# EAGLE design 3DAG (EAGLE 6.6.0)
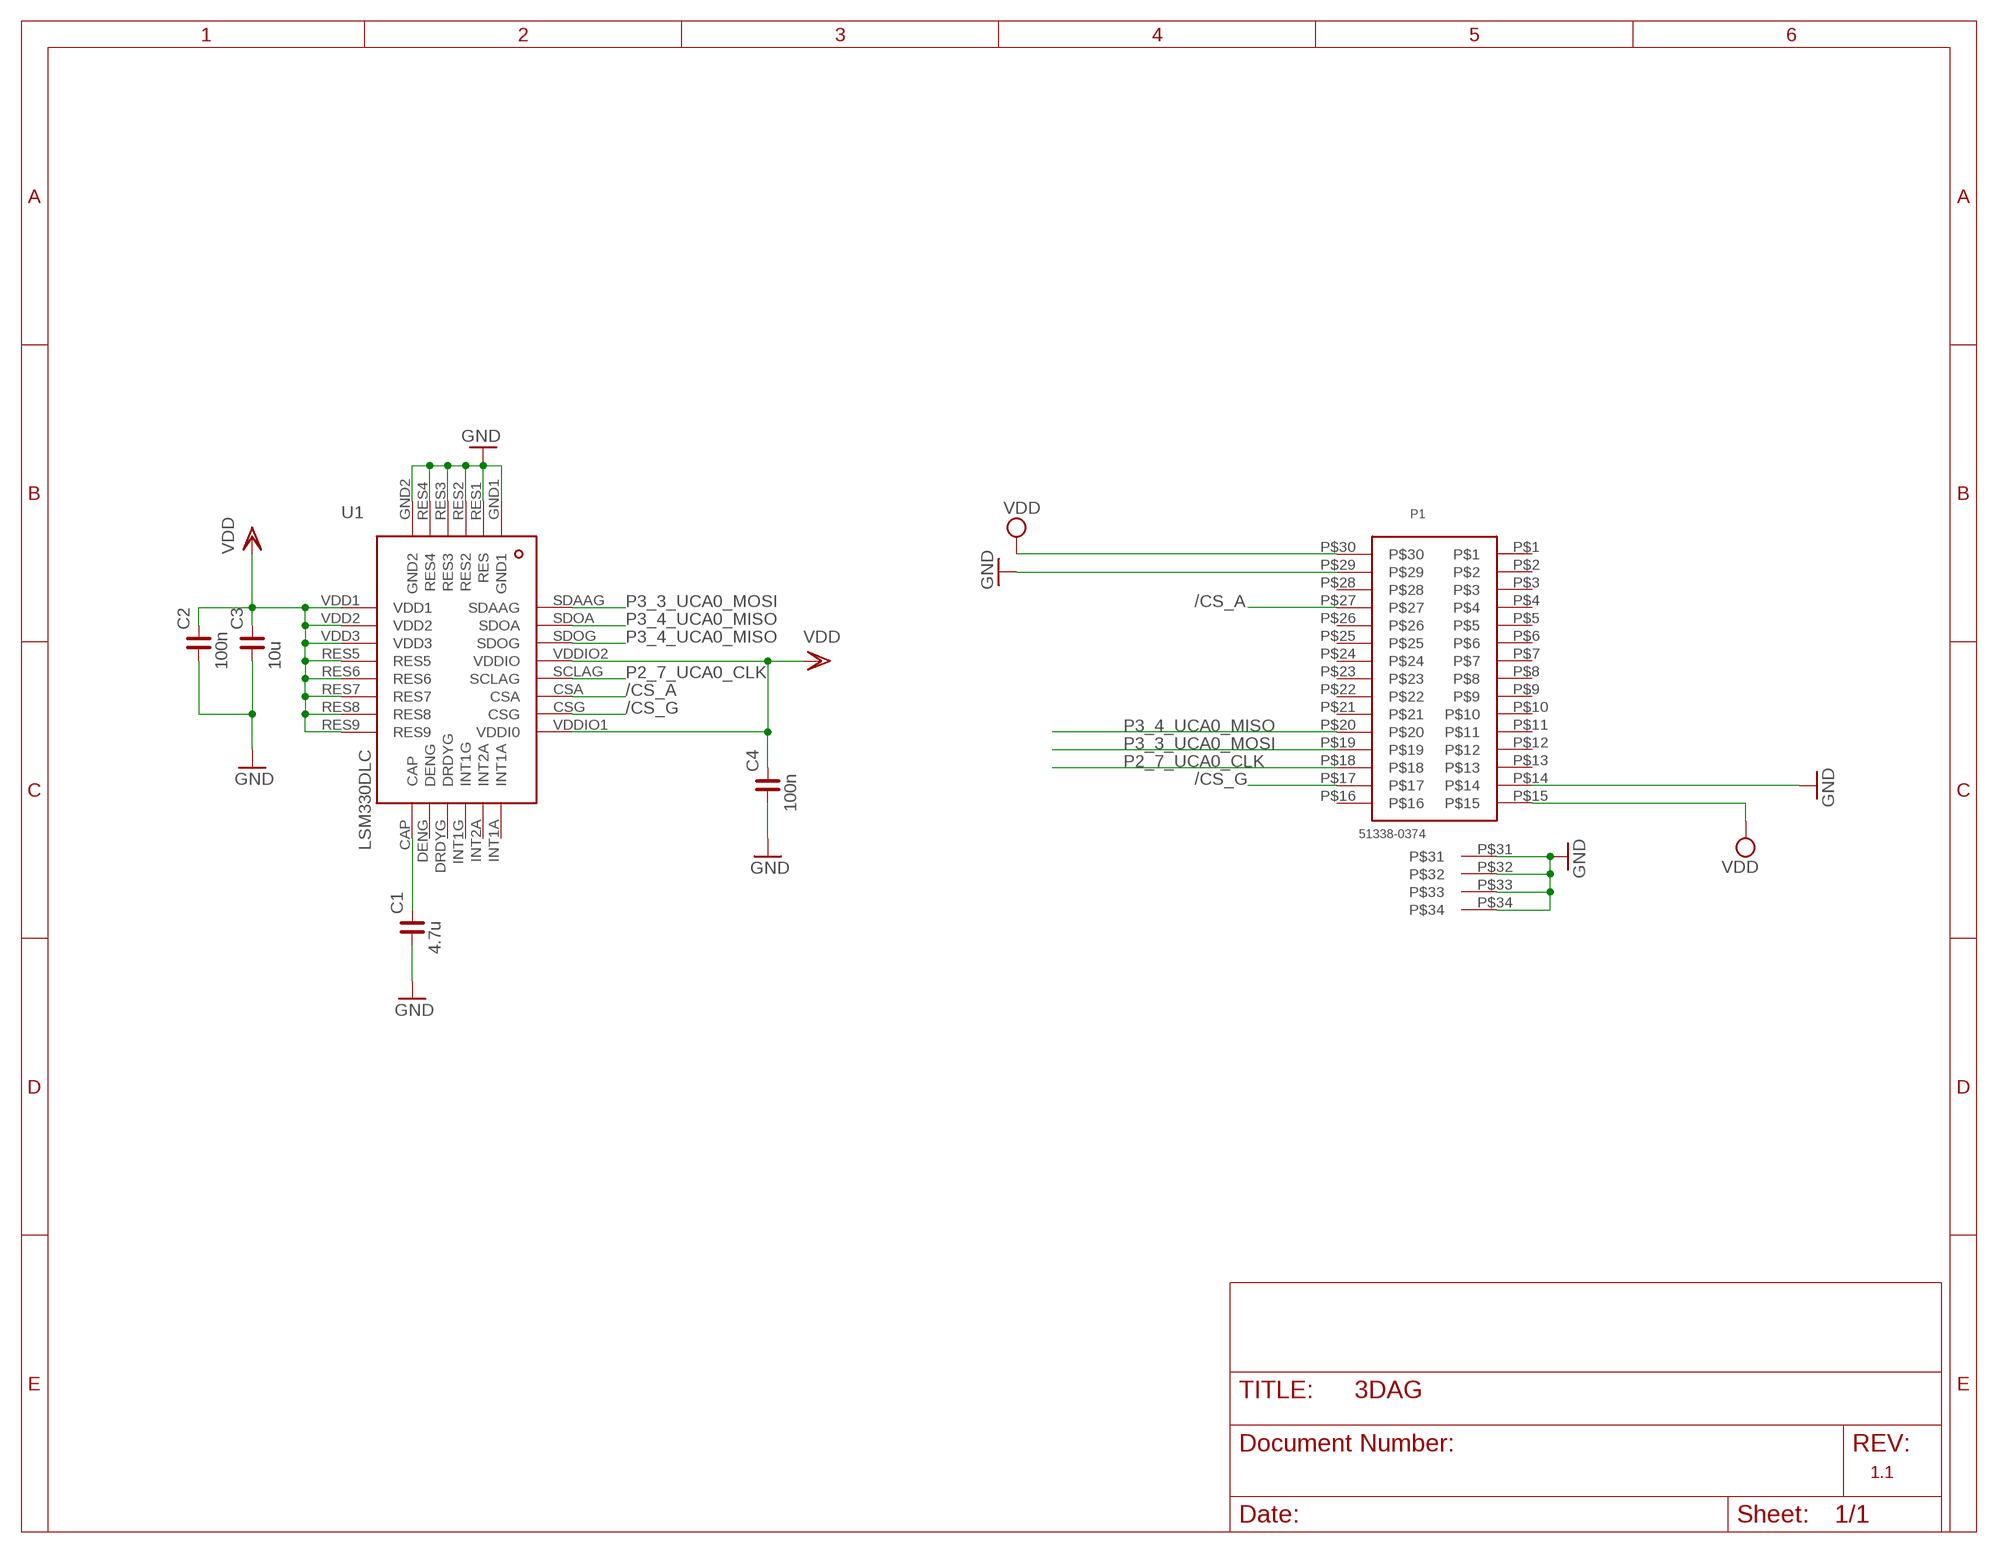
[diagram p0: schematic, sheet 1]

## Parts
C1  4.7u  C_0402  [C0402]
C2  100n  C_0402  [C0402]
C3  10u  C_0402  [C0402]
C4  100n  C_0402  [C0402]
P1  51338-0374  51338-0374_RECEPTACLE  [51338-0374_RECEPTACLE]
U$4  LSM330DLC  [LSM330DLC]

## Nets
/CS_A: P1.P$27 U$4.CSA
/CS_G: P1.P$17 U$4.CSG
GND: C1.1 C2.1 C3.1 C4.1 P1.P$14 P1.P$29 P1.P$31 P1.P$32 P1.P$33 P1.P$34 U$4.GND1 U$4.GND2 U$4.RES1(RES) U$4.RES2 U$4.RES3 U$4.RES4
N$5: C1.2 U$4.CAP
P2_7_UCA0_CLK: P1.P$18 U$4.SCLAG
P3_3_UCA0_MOSI: P1.P$19 U$4.SDAAG
P3_4_UCA0_MISO: P1.P$20 U$4.SDOA U$4.SDOG
VDD: C2.2 C3.2 C4.2 P1.P$15 P1.P$30 U$4.RES5 U$4.RES6 U$4.RES7 U$4.RES8 U$4.RES9 U$4.VDD1 U$4.VDD2 U$4.VDD3 U$4.VDDIO1(VDDI0) U$4.VDDIO2(VDDIO)
Unconnected: P1.P$1 P1.P$2 P1.P$3 P1.P$4 P1.P$5 P1.P$6 P1.P$7 P1.P$8 P1.P$9 P1.P$10 P1.P$11 P1.P$12 P1.P$13 P1.P$16 P1.P$21 P1.P$22 P1.P$23 P1.P$24 P1.P$25 P1.P$26 P1.P$28 U$4.DENG U$4.DRDYG U$4.INT1A U$4.INT1G U$4.INT2A

## Notes on the sheet
- U1
- 1.1

## Library data of the parts
C1-C4 = rc-master-smd:C_: NON-POLARIZED CAP
P1 = Molex_SlimStack:51338-0374_RECEPTACLE
U$4 = LSM330DLC:LSM330DLC

## Board
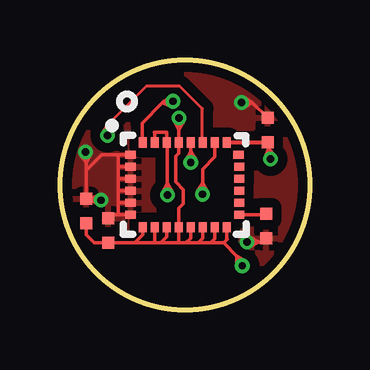
[diagram p1: board, top side]
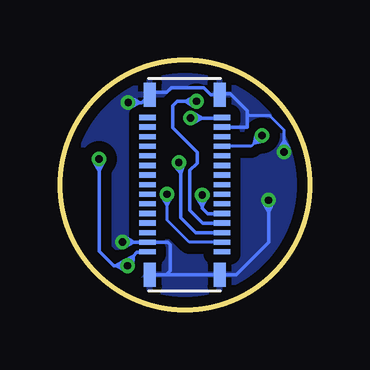
[diagram p2: board, bottom side, seen from below]

Size 10.4 x 10.4 mm. Coordinates in mm from the lower left corner, seen from the top.
Outline: circle at 5.2,5.2 radius 5.2
Copper layers (1*16): Top 0.035mm / dielectric 1.5mm / Bottom 0.035mm
Design rules "DIRTY_PCB": minimum track width 5mil, minimum drill 12mil, track to track 5mil, track to pad 5mil, pad to pad 5mil, via to via 5mil, smd to smd 0mil, copper to edge 10mil, drill to drill 10mil, minimum pad ring 10mil, minimum via ring 6mil, stop-mask expansion 2mil, vias tented up to drill 25mil, thermal gap 10mil

### Footprints (pad centres in the part's own frame; a part is rotated, then mirrored left to right if it is on the bottom)
C0402 = smd 0.5 x 0.5: 1 -0.508,0; 2 0.508,0
51338-0374_RECEPTACLE = smd 0.7 x 0.22: P$1 -1.55,2.8; P$2 -1.55,2.4; P$3 -1.55,2; P$4 -1.55,1.6; P$5 -1.55,1.2; P$6 -1.55,0.8; P$7 -1.55,0.4; P$8 -1.55,0; P$9 -1.55,-0.4; P$10 -1.55,-0.8; P$11 -1.55,-1.2; P$12 -1.55,-1.6; P$13 -1.55,-2; P$14 -1.55,-2.4; P$15 -1.55,-2.8; P$16 1.55,-2.8; P$17 1.55,-2.4; P$18 1.55,-2; P$19 1.55,-1.6; P$20 1.55,-1.2; P$21 1.55,-0.8; P$22 1.55,-0.4; P$23 1.55,0; P$24 1.55,0.4; P$25 1.55,0.8; P$26 1.55,1.2; P$27 1.55,1.6; P$28 1.55,2; P$29 1.55,2.4; P$30 1.55,2.8 | smd 0.5 x 1: P$31 1.45,3.75; P$32 -1.45,3.75; P$33 -1.45,-3.75; P$34 1.45,-3.75
LSM330DLC = smd 0.425 x 0.325: CAP 2.263,-1.25; DENG 2.263,-0.75; DRDYG 2.263,-0.25; GND1 -2.263,1.25; GND2 -2.263,-1.25; INT1A 2.237,1.25; INT1G 2.268,0.25; INT2A 2.263,0.75; RES1 -2.263,0.75; RES2 -2.263,0.25; RES3 -2.263,-0.25; RES4 -2.263,-0.75 | smd 0.325 x 0.425: CSA 0.75,1.762; CSG 1.25,1.762; RES5 -0.25,-1.762; RES6 0.25,-1.762; RES7 0.75,-1.762; RES8 1.25,-1.762; RES9 1.75,-1.762; SCLAG 0.25,1.762; SDAAG -1.75,1.762; SDOA -1.25,1.762; SDOG -0.75,1.762; VDD1 -1.75,-1.762; VDD2 -1.25,-1.762; VDD3 -0.75,-1.762; VDDIO1 1.75,1.762; VDDIO2 -0.25,1.762

### Placement (x,y rotation side)
C1  8.59,3.49 90 top
C2  2.02,3.29 270 top
C3  1.1,4.11 270 top
C4  8.65,7.48 270 top
P1  5.2,5.21 0 bottom
U$4  5.2,5.2 0 top

### Tracks (layer width: path | path; a pad name or v marks a point on that pad's centre or on a via)
/CS_A  (via drill 0.3)
  Top 0.127: U$4.CSA 5.93,6.98 5.93,8.37 5,9.31 3.59,9.31 1.99,7.71 | 1.99,7.71 v1.99,7.25 | 1.99,7.71 1.78,7.38 v1.99,7.25 | 1.99,7.71 2.19,7.38 v1.99,7.25
  Bottom 0.127: v1.99,7.25 2.31,6.93 | 2.31,6.93 2.43,6.81 P1.P$27 | 2.31,6.93 2.22,7.31 v1.99,7.25 | 2.31,6.93 1.93,7.02 v1.99,7.25
/CS_G  (via drill 0.3)
  Top 0.152: U$4.CSG 6.45,6.36 5.94,5.85 5.94,5.26 | 5.94,5.26 v5.94,4.81 | 5.94,5.26 5.74,4.92 v5.94,4.81 | 5.94,5.26 6.14,4.92 v5.94,4.81
  Bottom 0.127: P1.P$17 5.01,2.81 5.94,3.73 5.94,4.35 | 5.94,4.35 v5.94,4.81 | 5.94,4.35 6.14,4.68 v5.94,4.81 | 5.94,4.35 5.73,4.68 v5.94,4.81
  Bottom 0.152: v5.94,4.81
GND  (via drill 0.3)
  Top 0.152: 2.42,6.45 U$4.GND1 1.75,6.45 1.1,5.81 | 2.42,6.45 2.42,6.46 | 2.42,6.45 2.42,5.95 | 2.42,5.95 U$4.RES1 | U$4.RES2 2.42,5.45 | 2.42,5.45 2.42,5.95 | U$4.RES3 2.42,4.95 | 2.42,4.95 2.42,5.45 | U$4.RES4 2.42,4.45 | 2.42,4.45 2.42,4.95 | U$4.GND2 2.42,3.95 | 2.42,3.95 2.42,4.45 | 1.1,5.81 C3.1 1.26,4.61 | 2.42,3.95 2.17,3.95 C2.1 | v1.06,6.57 1.1,6.53 1.1,6.12 | 1.1,6.12 1.1,5.81 | v7.8,2.81 8.25,2.81 | 8.25,2.81 8.42,2.81 C1.1 | C4.1 8.02,8.62 | 8.02,8.62 8.01,8.62 v7.56,8.62 | v1.71,4.56 1.66,4.61 1.26,4.61 | 1.1,6.12 1.27,6.48 v1.06,6.57 | 1.1,6.12 0.87,6.44 v1.06,6.57 | 8.25,2.81 7.91,3.01 v7.8,2.81 | 8.25,2.81 7.91,2.62 v7.8,2.81 | 8.02,8.62 7.68,8.82 v7.56,8.62 | 8.02,8.62 7.67,8.43 v7.56,8.62 | 1.26,4.61 1.57,4.38 v1.71,4.56 | 1.26,4.61 1.62,4.77 v1.71,4.56
  Bottom 0.127: v1.06,6.57 1.06,7.03 | 1.06,7.03 1.06,7.48 1.66,8.08 2.5,8.08 2.6,8.19 | 1.06,7.03 0.86,6.7 v1.06,6.57 | 1.06,7.03 1.27,6.7 v1.06,6.57
  Bottom 0.152: P1.P$29 2.6,7.61 2.6,8.19 2.6,8.29 3.3,8.99 3.72,8.99 P1.P$31 4.12,8.96 4.41,9.25 5.76,9.25 5.95,9.05 6.56,9.05 P1.P$32 6.98,8.62 7.1,8.62 | 7.34,2.81 P1.P$14 5.91,2.8 5.8,2.7 5.8,1.62 5.97,1.46 P1.P$33 P1.P$34 3.05,1.45 1.71,2.8 1.71,4.1 | 7.34,2.81 v7.8,2.81 | 7.1,8.62 v7.56,8.62 | 1.71,4.1 v1.71,4.56 | 7.34,2.81 7.68,2.62 v7.8,2.81 | 7.34,2.81 7.68,3.01 v7.8,2.81 | 7.1,8.62 7.45,8.43 v7.56,8.62 | 7.1,8.62 7.45,8.82 v7.56,8.62 | 1.71,4.1 1.91,4.45 v1.71,4.56 | 1.71,4.1 1.51,4.45 v1.71,4.56
  pour Top (isolate 0.4): 0.2,5.2 arc-90 5.2,10.2 arc-90 10.2,5.2 arc-90 5.2,0.2 arc-91
  pour Bottom (isolate 0.432): 0.2,5.2 arc-90 5.2,10.2 arc-90 10.2,5.2 arc-90 5.2,0.2 arc-91
N$5
  Top 0.152: U$4.CAP 8.54,3.95 C1.2
P2_7_UCA0_CLK  (via drill 0.3)
  Top 0.152: v5.45,6.12 5.45,6.58 | 5.45,6.58 U$4.SCLAG | 5.45,6.58 5.25,6.24 v5.45,6.12 | 5.45,6.58 5.65,6.24 v5.45,6.12
  Bottom 0.152: P1.P$18 4.75,3.21 5.37,3.83 5.37,5.67 | 5.37,5.67 5.37,6.04 v5.45,6.12 | 5.37,5.67 5.62,5.98 v5.45,6.12 | 5.37,5.67 5.23,6.05 v5.45,6.12
P3_3_UCA0_MOSI  (via drill 0.3)
  Top 0.152: U$4.SDAAG 3.42,6.99 3.42,7.77 4.26,8.61 | 4.26,8.61 4.33,8.68 v4.71,8.68 | 4.26,8.61 4.63,8.47 v4.71,8.68 | 4.26,8.61 4.57,8.86 v4.71,8.68
  Bottom 0.152: P1.P$19 4.46,3.61 4.99,4.13 4.99,5.8 4.69,6.11 4.69,6.56 5.7,7.57 5.7,8.49 5.51,8.68 5.17,8.68 | 5.17,8.68 v4.71,8.68 | 5.17,8.68 4.83,8.88 v4.71,8.68 | 5.17,8.68 4.83,8.48 v4.71,8.68
P3_4_UCA0_MISO  (via drill 0.3)
  Top 0.152: v4.47,4.78 4.47,5.24 | 4.47,5.24 4.47,6.94 arc90 U$4.SDOG 4.45,7.4 3.93,7.4 3.95,7.38 U$4.SDOA | 4.47,5.24 4.28,4.89 v4.47,4.78 | 4.47,5.24 4.67,4.89 v4.47,4.78
  Bottom 0.152: P1.P$20 4.25,4 4.47,4.23 4.47,4.32 | 4.47,4.32 v4.47,4.78 | 4.47,4.32 4.67,4.66 v4.47,4.78 | 4.47,4.32 4.28,4.66 v4.47,4.78
VDD  (via drill 0.3)
  Top 0.152: C3.2 1.1,3.12 1.43,2.78 C2.2 3.12,2.78 | U$4.VDD1 3.45,3.11 3.12,2.78 | U$4.VDD2 3.96,2.82 3.92,2.78 | 3.92,2.78 3.12,2.78 | U$4.VDD3 4.46,3.04 4.2,2.78 | 4.2,2.78 3.92,2.78 | 4.92,2.78 4.95,2.81 U$4.RES5 4.95,4.22 5.14,4.41 5.14,5 4.83,5.32 4.83,6.4 4.95,6.52 U$4.VDDIO2 | 4.92,2.78 4.2,2.78 | U$4.RES6 5.45,2.98 5.25,2.78 | 5.25,2.78 4.92,2.78 | U$4.RES7 5.95,2.97 5.77,2.78 | 5.77,2.78 5.25,2.78 | U$4.VDDIO2 4.95,7.52 | 4.95,7.52 v4.95,7.97 v4.96,7.98 | U$4.RES8 6.45,2.95 6.44,2.95 6.28,2.78 | 6.28,2.78 5.77,2.78 | U$4.RES9 6.95,2.92 6.96,2.92 6.82,2.78 | 6.82,2.78 6.28,2.78 | C4.2 U$4.VDDIO1 8.45,6.96 8.69,6.72 | v7.59,1.83 7.59,2.01 7.37,2.23 | 7.37,2.23 6.82,2.78 | 8.69,6.72 8.7,6.71 8.7,6.34 v8.77,6.27 | U$4.VDDIO2 | 4.95,7.52 5.16,7.86 v4.96,7.98 | 4.95,7.52 4.76,7.87 v4.96,7.98 | 7.37,2.23 7.37,1.83 v7.59,1.83 | 7.37,2.23 7.71,2.02 v7.59,1.83 | 8.69,6.72 8.56,6.35 v8.77,6.27 | 8.69,6.72 8.95,6.42 v8.77,6.27
  Bottom 0.152: P1.P$30 3.68,7.98 4.36,7.98 | v4.96,7.98 4.5,7.98 | 4.5,7.98 4.36,7.98 | 4.36,7.98 | P1.P$15 6.78,2.38 7.19,2.38 7.36,2.22 | 7.36,2.22 7.59,1.98 v7.59,1.83 | v8.77,6.27 8.77,5.82 | 8.77,5.82 8.77,2.44 8.16,1.83 8.05,1.83 | 8.05,1.83 v7.59,1.83 | 4.5,7.98 4.85,7.78 v4.96,7.98 | 4.5,7.98 4.85,8.18 v4.96,7.98 | 7.36,2.22 7.37,1.82 v7.59,1.83 | 7.36,2.22 7.7,2.03 v7.59,1.83 | 8.05,1.83 7.71,2.03 v7.59,1.83 | 8.05,1.83 7.71,1.63 v7.59,1.83 | 8.77,5.82 8.97,6.16 v8.77,6.27 | 8.77,5.82 8.57,6.16 v8.77,6.27